# Altium project Beanbag_Board.PrjPcb
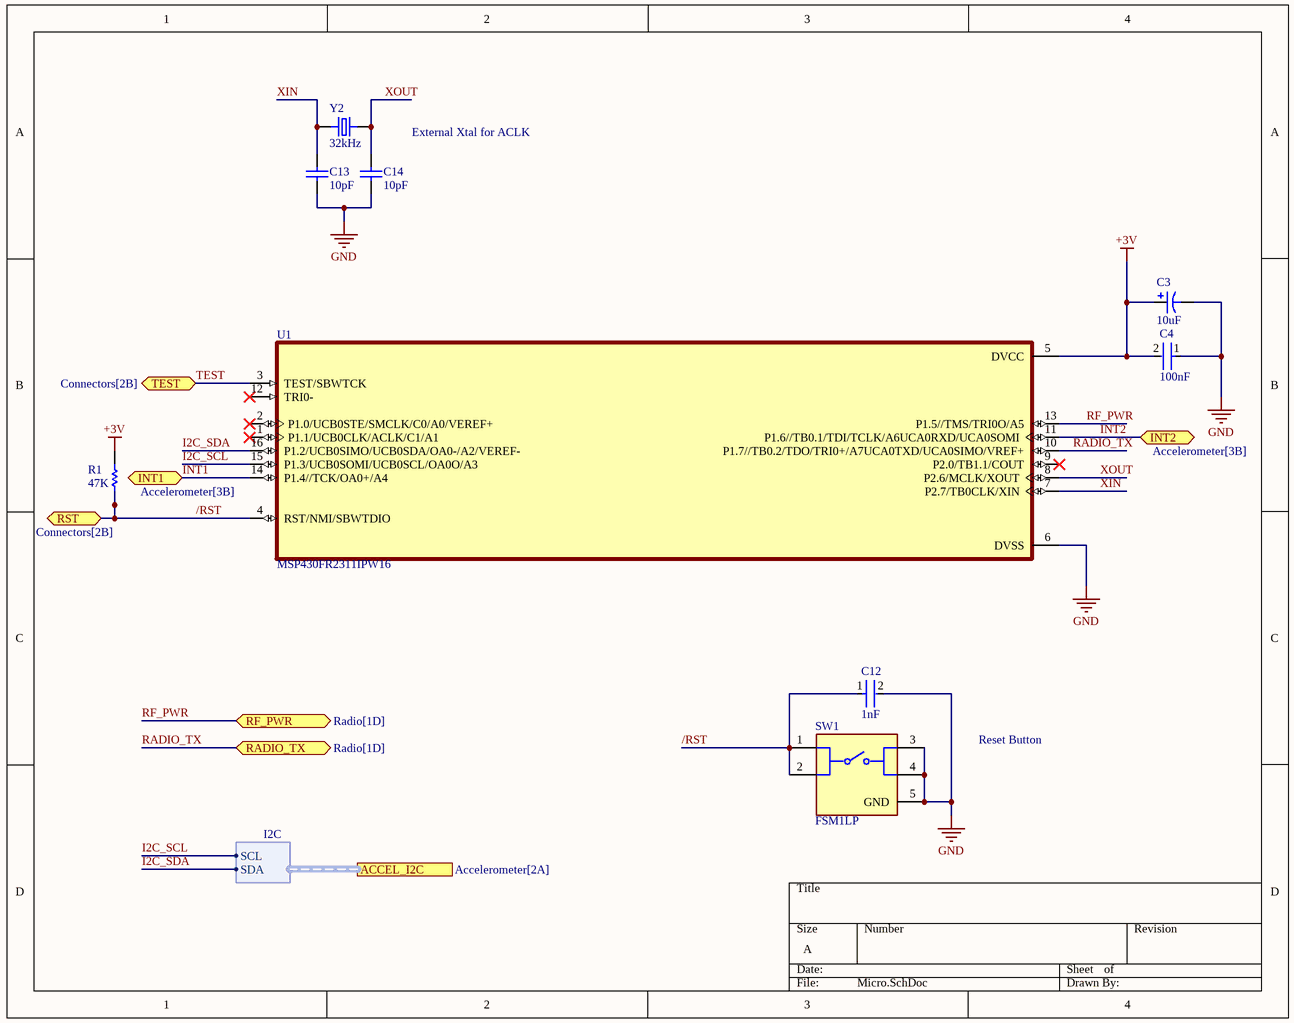
[diagram p0: Micro.SchDoc]
5 sheets, 34 parts. Net scope: flat (ports and power ports of the same name join across sheets).
Board file: Beanbag.PcbDoc
Sheets:
  Micro.SchDoc
  Accelerometer.SchDoc
  Connectors.SchDoc
  Power.SchDoc
  Radio.SchDoc

## Sheet Micro.SchDoc
size A; SheetNumber: 1; SheetTotal: 5; SPICEModelCacheCJDBQKXO: <root> / <DocumentId>CJDBQKXO</DocumentId> / <CacheFrame Number="0"> / <Model Name="cap" Kind="MDL"> / <Text>*Default semiconductor capacitor / .MODEL CAP C()</Text> / </Model> / </CacheFrame> / </root>

### Parts
C3  10uF  [C0805]
C4  100nF  [FP-C0402-BB-MFG]
C12  1nF  [FP-0603-L_1_6_0_15-W_0_81-IPC_A]
C13  10pF  [CAPC1608X90X40ML10T20]
C14  10pF  [CAPC1608X90X40ML10T20]
R1  47K  [J1-0603]
SW1  FSM1LP  [FP-FSM1LP-MFG]
U1  MSP430FR2311IPW16  [SOP65P640X120-16N]
Y2  32kHz  [XTAL_ECS-.327-6-34RR-TR]

### Ports
ACCEL_I2C (harness I2C, see Accelerometer[2A]), INT1 (bidir, see Accelerometer[3B]), INT2 (bidir, see Accelerometer[3B]), RADIO_TX (bidir, see Radio[1D]), RF_PWR (bidir, see Radio[1D]), RST (bidir, see Connectors[2B]), TEST (bidir, see Connectors[2B])

### Harnesses
I2C: SDA, SCL

### Nets
+3V: C3.1 C4.2 R1.2 U1.5(DVCC)
GND: C3.2 C4.1 C12.2 C13.1 C14.1 SW1.3 SW1.4 SW1.5(GND) U1.6(DVSS)
/RST: C12.1 R1.1 SW1.1 SW1.2 U1.4(RST/NMI/SBWTDIO) ; port RST
I2C_SCL: U1.15(P1.3/UCB0SOMI/UCB0SCL/OA0O/A3) ; port ACCEL_I2C.SCL
I2C_SDA: U1.16(P1.2/UCB0SIMO/UCB0SDA/OA0-/A2/VEREF-)
INT1: U1.14(P1.4//TCK/OA0+/A4) ; port INT1
INT2: U1.11(P1.6//TB0.1/TDI/TCLK/A6UCA0RXD/UCA0SOMI) ; port INT2
RADIO_TX: U1.10(P1.7//TB0.2/TDO/TRI0+/A7UCA0TXD/UCA0SIMO/VREF+) ; port RADIO_TX
RF_PWR: U1.13(P1.5//TMS/TRI0O/A5) ; port RF_PWR
TEST: U1.3(TEST/SBWTCK) ; port TEST
XIN: C13.2 U1.7(P2.7/TB0CLK/XIN) Y2.1(I/O)
XOUT: C14.2 U1.8(P2.6/MCLK/XOUT) Y2.2(O/I)

Not connected (* = marked no-connect by the designer): U1 1(P1.1/UCB0CLK/ACLK/C1/A1)* 2(P1.0/UCB0STE/SMCLK/C0/A0/VEREF+)* 9(P2.0/TB1.1/COUT)* 12(TRI0-)*

### Notes on the sheet
- External Xtal for ACLK
- Reset Button

### Library data of the parts
C3 = Cap Pol3: Alum. Electrolytic Cap 10µF 50V; 5mm Surface Mount; Lifetime 2000h; +105°C; Manufacturer: Wurth Electronics; Manufacturer Part Number: 865080642006; Polarity: Polar; Ripple Current: 95mA; Impedance: 2.8R; Life (Hours): 2000Hour; Tolerance: 20%; Published: 8-Jun-2000; LatestRevisionDate: 29-May-2009; LatestRevisionNote: IPC-7351 Footprint Added.; PackageReference: C0805; Publisher: Altium Limited; PackageDescription: Chip Capacitor; RoHS: Yes; Category: Aluminum Electrolytic Capacitors; Stock 1: 1; Pricing 1: 25=0.20400 (USD); Mount: Surface Mount; Case/Package: Radial; Min Operating Temperature: -55°C; Max Operating Temperature: 105°C; Package Quantity: 1; Packaging: Cut Tape; Voltage Rating: 50V; Ripple Current (AC): 95mA; Voltage Rating (DC): 50V; Capacitance: 10uF; Diameter: 5mm; Height: 5.5mm; Height - Seated (Max): 0.217inch; REACH SVHC: Unknown; RoHS Compliant: Yes; ComponentLink1URL: http://www.farnell.com/datasheets/1880176.pdf?src-supplier=Farnell; ComponentLink1Description: http://www.farnell.com/datasheets/1880176.pdf?src-supplier=Farnell; ComponentLink2URL: http://www.farnell.com/datasheets/1880176.pdf?src-supplier=Element14; ComponentLink2Description: http://www.farnell.com/datasheets/1880176.pdf?src-supplier=Element14; ComponentLink3URL: http://www.farnell.com/datasheets/1880176.pdf?src-supplier=Newark; ComponentLink3Description: http://www.farnell.com/datasheets/1880176.pdf?src-supplier=Newark; ComponentLink4URL: http://katalog.we-online.de/pbs/datasheet/865080642006.pdf?src-supplier=Digi-Key; ComponentLink4Description: http://katalog.we-online.de/pbs/datasheet/865080642006.pdf?src-supplier=Digi-Key; ComponentLink5URL: https://katalog.we-online.de/pbs/datasheet/865080642006.pdf?src-supplier=Digi-Key; ComponentLink5Description: https://katalog.we-online.de/pbs/datasheet/865080642006.pdf?src-supplier=Digi-Key; Supplier 1: RSComponents; Supplier Part Number 1: 8391862P
C4 = CMP-2008-02046-2: CAP CER 0.1UF 10V X5R 0402; Manufacturer: Kemet; Manufacturer Part Number: C0402C104K8PACTU; Material: Ceramic; Capacitance: 0.10 μF; Temperature Coefficient: 15%; Tolerance: 0.1; Value: 0.10 μF; Package: C0402-BB; Temperature: -55°C to +125°C; ComponentLink2Description: Datasheet; Temperature Characteristic: X5R; Device Class L1: Passive Components; Height: 0.55mm; Lead Free: Yes; ComponentLink2URL: https://content.kemet.com/datasheets/KEM_C1002_X7R_SMD.pdf; Device Class L2: Capacitors; Temperature Range Low: -55°C; Temperature Range High: +125°C; RoHS: TRUE; Octopart: https://octopart.com/c0402c104k8pactu-kemet-140039; Automotive: No; Mouser Description: Capacitor 100 nF 10 VDC 0402; Category: Cap; Voltage Rating: 10 V; Digikey Description: CAP CER 0.1UF 10V X5R 0402; Ipc Land Pattern Name: CAPC10050X50; Device Class L3: Ceramic Capacitors
C12 = CMP-2006-04378-2: General Purpose Ceramic Capacitor, 0603, 1nF, 10%, X7R, 15%, 50V; Case Code (Metric): 1608; Min Operating Temperature: -55°C; Weight: 7.1E-05oz; Series: -; Capacitance: 1nF; RoHS Compliant: Yes; Radiation Hardening: No; Height: 0.9mm; Mount: Surface Mount; REACH SVHC: No SVHC; Lead Free: Lead Free; Depth: 0.81mm; Voltage: 50V; Number of Pins: 2; Voltage Rating: 50V; Max Operating Temperature: 125°C; Termination: SMD/SMT; Construction: Flat; Case Code (Imperial): 0603; Dielectric: X7R; Width: 0.032inch; Tolerance: 10%; Case/Package: 0603; Contact Plating: Tin; Packaging: Tape and Reel; Voltage Rating (DC): 50V; Dielectric Material: Ceramic; Package Quantity: 4000; Thickness: 0.035inch; Length: 1.6mm; Supplier 1: Arrow Electronics; Supplier Part Number 1: 06035C102KAT2A
C13 C14 = CMP-2100-03593-1: Chip Capacitor, 10 pF, +/- 5%, 50 V, -55 to 125 degC, 0603 (1608 Metric), RoHS, Tape and Reel; Manufacturer: Yageo; Insulation Resistance: 100GR; Voltage Rating: 50V; Temperature Coefficient: 30ppm/degC; Dielectric: C0G; Radiation Hardening: No; Mount: SurfaceMount; Width: 0.031inch; Composition: Ceramic; Package Description: 2-Pin Surface Mount Device, Body 1.6 x 0.8 mm; Min Operating Temperature: -55degC; Case Code (Metric): 1608; Datasheet URL: http://www.yageo.com/documents/recent/UPY-GP_NP0_16V-to-50V_14.pdf; Termination: SMD/SMT; REACH SVHC: NoSVHC; Case/Package: 0603; RoHSCompliant: True; Packaging: TapeandReel; Max Operating Temperature: 125degC; Voltage: 50V; Package Quantity: 1; Manufacturer URL: http://www.yageo.com/; Tolerance: 5%; Capacitance: 10pF; Height: 0.8mm; Depth: 0.8mm; Thickness: 0.035inch; Case Code (Imperial): 0603; Length: 1.6mm; Package Reference: 0603; Voltage Rating (DC): 50V; Lead Free: LeadFree; Number of Pins: 2; Datasheet Version: Rev. 14, 07/2016; Supplier 1: Arrow Electronics; Supplier Part Number 1: CC0603JRNPO9BN100
R1 = Res1: Resistor; Published: 8-Jun-2000; LatestRevisionDate: 17-Jul-2002; LatestRevisionNote: Re-released for DXP Platform.; PackageReference: AXIAL-0.3; Publisher: Altium Limited; PackageDescription: Axial Device, Thru-Hole; 2 Leads; 0.3 in Pin Spacing; Value: 47K
SW1 = CMP-03402-000015-1: SWITCH TACTILE SPST-NO 0.05A 24V; Electrical Life: 100000Cycles; Actuator Type: Standard; Contact Resistance: 100mR; Current Rating: 50mA; Operating Force: 1.57N; Actuator Material: Polyphthalamide; Illumination Type: Non-Illuminated; Actuator Length: 0.01inch; Voltage Rating (DC): 12V; Throw Configuration: SPST; Switch Travel: 0.25mm; Switch Function: Off-Mom; Actuator Color: Black; Length: 6.19mm; Min Operating Temperature: -35°C; Contact Material: Copper Alloy; Max Current Rating: 50mA; Max Operating Temperature: 85°C; Packaging: Loose Piece; Lead Free: Lead Free; Mount: Surface Mount; RoHS Compliant: Yes; Orientation: Straight; Package Quantity: 2000; Mechanical Life: 100000Cycles; Type: Switch; ELV: Compliant; Depth: 8mm; Contact Plating: Silver; Max Voltage Rating (DC): 12V; REACH SVHC: No SVHC; Series: FSM1LP; Contact Current Rating: 50mA; Termination: Gull Wing; Supplier 1: Arrow Electronics; Supplier Part Number 1: FSM1LP
U1 = MSP430FR2311IPW16: 16MHz integrated analog microcontroller with 3.75KB FRAM, Op-Amp, TIA, Comparator w/ DAC, 10-bit ADC 16-TSSOP -40 to 85; MF: Texas Instruments; SnapEDA_Link: https://www.snapeda.com/parts/MSP430FR2311IPW16/Texas+Instruments/view-part/?ref=snap; Availability: In Stock; Package: TSSOP-16 Texas Instruments; Check_prices: https://www.snapeda.com/parts/MSP430FR2311IPW16/Texas+Instruments/view-part/?ref=eda; Price: None; MP: MSP430FR2311IPW16; Purchase-URL: https://pricing.snapeda.com/search/part/MSP430FR2311IPW16/?ref=eda; Value: *
Y2 = ECS-.327-6-34RR-TR: 32.768kHz Â±20ppm Crystal 6pF 40 kOhms 2-SMD, No Lead; MF: ECS Inc.; SnapEDA_Link: https://www.snapeda.com/parts/ECS-.327-6-34RR-TR/ECS%20Inc./view-part/2047718/?ref=snap; Value: *; MP: ECS-.327-6-34RR-TR; Package: SMD-2 TE Connectivity; DigiKey-Purchase-URL: https://snapeda.com/shop?store=DigiKey&id=2047718; Digi-Key_Part_Number: XC2296CT-ND; Supplier 1: Digi-Key; Supplier Part Number 1: XC2296CT-ND

## Sheet Accelerometer.SchDoc
size A; SheetNumber: 2; SheetTotal: 5; SPICEModelCacheEDZXGBKT: <root> / <DocumentId>EDZXGBKT</DocumentId> / <CacheFrame Number="0"> / <Model Name="cap" Kind="MDL"> / <Text>*Default semiconductor capacitor / .MODEL CAP C()</Text> / </Model> / </CacheFrame> / </root>
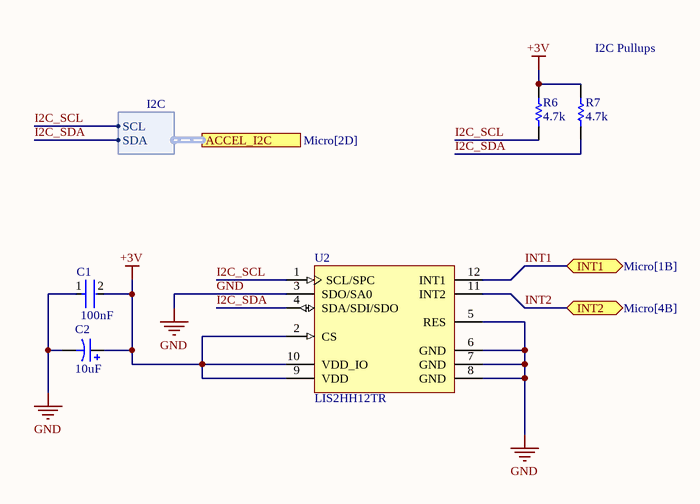
[diagram p1: Accelerometer.SchDoc]

### Parts
C1  100nF  [FP-C0402-BB-MFG]
C2  10uF  [C0805]
R6  4.7k  [RESC1608X55X30NL15T15]
R7  4.7k  [RESC1608X55X30NL15T15]
U2  LIS2HH12TR  [STM-LGA-12]

### Ports
ACCEL_I2C (harness I2C, see Micro[2D]), INT1 (bidir, see Micro[1B]), INT2 (bidir, see Micro[4B])

### Harnesses
I2C: SCL, SDA

### Nets
+3V: C1.2 C2.1 R6.2 R7.2 U2.2(CS) U2.9(VDD) U2.10(VDD_IO)
GND: C1.1 C2.2 U2.3(SDO/SA0) U2.5(RES) U2.6(GND) U2.7(GND) U2.8(GND)
I2C_SCL: R6.1 U2.1(SCL/SPC)
I2C_SDA: R7.1 U2.4(SDA/SDI/SDO) ; port ACCEL_I2C.SDA
INT1: U2.12(INT1) ; port INT1
INT2: U2.11(INT2) ; port INT2

### Notes on the sheet
- I2C Pullups

### Library data of the parts
C1 = CMP-2008-02046-2: as C4 on sheet Micro; Package: C0402-BB; Temperature: -55°C to +125°C; ComponentLink2Description: Datasheet; Temperature Characteristic: X5R; Device Class L1: Passive Components; Height: 0.55mm; Lead Free: Yes; ComponentLink2URL: https://content.kemet.com/datasheets/KEM_C1002_X7R_SMD.pdf; Device Class L2: Capacitors; Temperature Range Low: -55°C; Temperature Range High: +125°C; RoHS: TRUE; Octopart: https://octopart.com/c0402c104k8pactu-kemet-140039; Automotive: No; Mouser Description: Capacitor 100 nF 10 VDC 0402; Category: Cap; Voltage Rating: 10 V; Digikey Description: CAP CER 0.1UF 10V X5R 0402; Ipc Land Pattern Name: CAPC10050X50; Device Class L3: Ceramic Capacitors
C2 = Cap Pol3: as C3 on sheet Micro; Published: 8-Jun-2000; LatestRevisionDate: 29-May-2009; LatestRevisionNote: IPC-7351 Footprint Added.; PackageReference: C0805; Publisher: Altium Limited; PackageDescription: Chip Capacitor; RoHS: Yes; Category: Aluminum Electrolytic Capacitors; Stock 1: 1; Pricing 1: 25=0.20400 (USD); Mount: Surface Mount; Case/Package: Radial; Min Operating Temperature: -55°C; Max Operating Temperature: 105°C; Package Quantity: 1; Packaging: Cut Tape; Voltage Rating: 50V; Ripple Current (AC): 95mA; Voltage Rating (DC): 50V; Capacitance: 10uF; Diameter: 5mm; Height: 5.5mm; Height - Seated (Max): 0.217inch; REACH SVHC: Unknown; RoHS Compliant: Yes; ComponentLink1URL: http://www.farnell.com/datasheets/1880176.pdf?src-supplier=Farnell; ComponentLink1Description: http://www.farnell.com/datasheets/1880176.pdf?src-supplier=Farnell; ComponentLink2URL: http://www.farnell.com/datasheets/1880176.pdf?src-supplier=Element14; ComponentLink2Description: http://www.farnell.com/datasheets/1880176.pdf?src-supplier=Element14; ComponentLink3URL: http://www.farnell.com/datasheets/1880176.pdf?src-supplier=Newark; ComponentLink3Description: http://www.farnell.com/datasheets/1880176.pdf?src-supplier=Newark; ComponentLink4URL: http://katalog.we-online.de/pbs/datasheet/865080642006.pdf?src-supplier=Digi-Key; ComponentLink4Description: http://katalog.we-online.de/pbs/datasheet/865080642006.pdf?src-supplier=Digi-Key; ComponentLink5URL: https://katalog.we-online.de/pbs/datasheet/865080642006.pdf?src-supplier=Digi-Key; ComponentLink5Description: https://katalog.we-online.de/pbs/datasheet/865080642006.pdf?src-supplier=Digi-Key; Supplier 1: RSComponents; Supplier Part Number 1: 8391862P
R6 R7 = CMP-1012-00586-3: Precision Thick Film Chip Resistor, 4.7 KOhm, +/- 1%, -55 to 155 degC, 0603 (1608 Metric), RoHS, Tape and Reel; Resistance: 220 Ohm; Voltage Rating: 50 V; Elements: 4; Case\Package: 1205; Tolerance: 5%; Power Rating: 250 mW; PackageReference: 0603; Max Operating Temperature: 125 degC; REACH SVHC: No SVHC; Width: 0.063 inch; Length: 0.126 inch; Height: 0.024 inch; Mount: Surface Mount; Package Quantity: 1; DatasheetVersion: Apr-15; ComponentLink1Description: Manufacturer URL; Min Operating Temperature: -55 degC; Packaging: Tape and Reel; Radiation Hardening: No; ComponentLink2URL: http://industrial.panasonic.com/cdbs/www-data/pdf/RDA0000/AOA0000C86.pdf; Case Code (Metric): 3216; Pins: 8; Case Code (Imperial): 1206; Type (Resistor): Thick Film; RoHSCompliant: true; ComponentLink2Description: Datasheet; PackageDescription: 2-Pin Surface Mount Device, Body 1.6 x 0.85 mm; ComponentLink1URL: http://www.panasonic.com/; Supplier 1: Digi-Key; Supplier Part Number 1: P4.70KHCT-ND
U2 = CMP-2000-07462-1: MEMS Digital Output Motion Sensor: Ultra-Low-Power High-Performance 3-Axis "Pico" Accelerometer, 1.71 to 3.6 V, -40 to 85 degC, 12-Pin LGA, RoHS, Tape and Reel; Manufacturer: STMicroelectronics; Bandwidth: 400Hz; Package Description: 12-Pin Land Grid Array Package, Body 2 x 2 mm, Pitch 0.5 mm; Manufacturer URL: http://www.st.com/; Lead Free: LeadFree; Case\/Package: LGA; RoHSCompliant: true; Min Operating Temperature: -40degC; Mounting Technology: SurfaceMount; Packaging: TapeandReel; Max Operating Temperature: 85degC; Mount: SurfaceMount; Number of Pins: 12; Datasheet URL: http://www.st.com/content/ccc/resource/technical/document/datasheet/c9/16/f2/79/ca/31/47/89/DM00096789.pdf/files/DM00096789.pdf/jcr:content/translations/en.DM00096789.pdf; Contact Plating: Gold; Package Reference: LGA-12; Datasheet Version: Rev. 5, 12/2015

## Sheet Connectors.SchDoc
size A; SheetNumber: 3; SheetTotal: 5
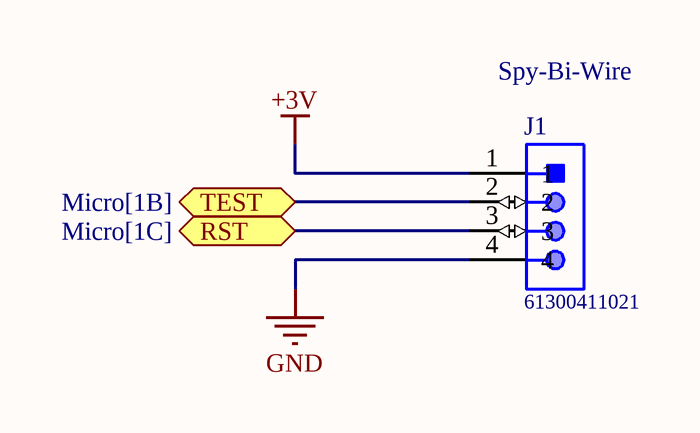
[diagram p2: Connectors.SchDoc]

### Parts
J1  61300411021  [61300411021]

### Ports
RST (bidir, see Micro[1C]), TEST (bidir, see Micro[1B])

### Nets
+3V: J1.1
GND: J1.4
/RST: J1.3 ; port RST
TEST: J1.2 ; port TEST

### Notes on the sheet
- (near J1) Spy-Bi-Wire

### Library data of the parts
J1 = CMP-1502-01063-1: THT Angled Pin Header WR-PHD, Pitch 2.54 mm, Single Row, 4 pins; Manufacturer: Wurth Elektronik; Gender: Male; Pin Number: 4; Withstanding Voltage: 500VAC; Working Voltage: 250VAC; Contact Resistance: 20mOhm; Pitch: 2.54mm; Rated Current: 3A; Manufacturer URL: http://www.we-online.de; Mounting Technology: THT; Publisher: WurthElektronik; Operating Temperature: -40to105degC; Packaging: Bag; Row Number: Single; Package Reference: 61300411021; Part Number: 61300411021; Orientation: Angled; Datasheet URL: https://katalog.we-online.de/em/datasheet/6130xx11021.pdf

## Sheet Power.SchDoc
size A; SheetNumber: 4; SheetTotal: 5
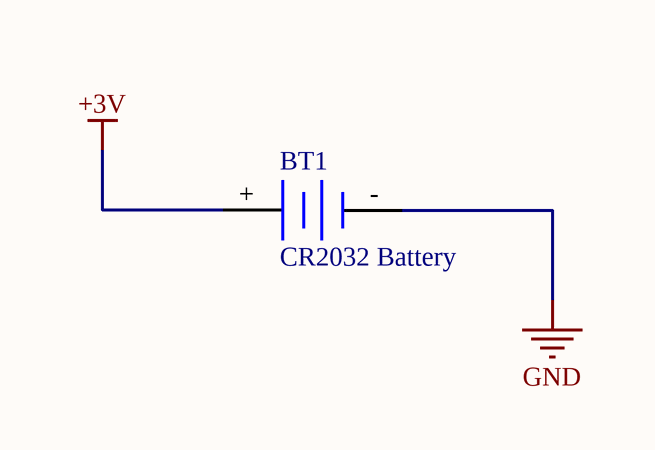
[diagram p3: Power.SchDoc]

### Parts
BT1  CR2032 Battery  [PCBComponent_1]

### Nets
+3V: BT1.+
GND: BT1.-

### Library data of the parts
BT1 = Battery: Multicell Battery; pin to pad: 1>+ 2>-; Published: 24-Mar-1999; LatestRevisionDate: 17-Jul-2002; LatestRevisionNote: Re-released for DXP Platform.; PackageReference: BAT-2; Publisher: Altium Limited; PackageDescription: Battery; 2 Leads; Supplier 1: Digi-Key; Supplier Part Number 1: 2057-BH-49E-5-BK-ND

## Sheet Radio.SchDoc
size A; SheetNumber: 5; SheetTotal: 5; SPICEModelCacheYGONGDQV: <root> / <DocumentId>YGONGDQV</DocumentId> / <CacheFrame Number="0"> / <Model Name="pmos" Kind="MDL"> / <Text>*Default P-Channel MOSFET / *Pinout: D,G,S / .MODEL PMOS PMOS()</Text> / </Model> / <Model Name="cap" Kind="MDL"> / <Text>*Default semiconductor capacitor / .MODEL CAP C()</Text> / </Model> / </CacheFrame> / </root>
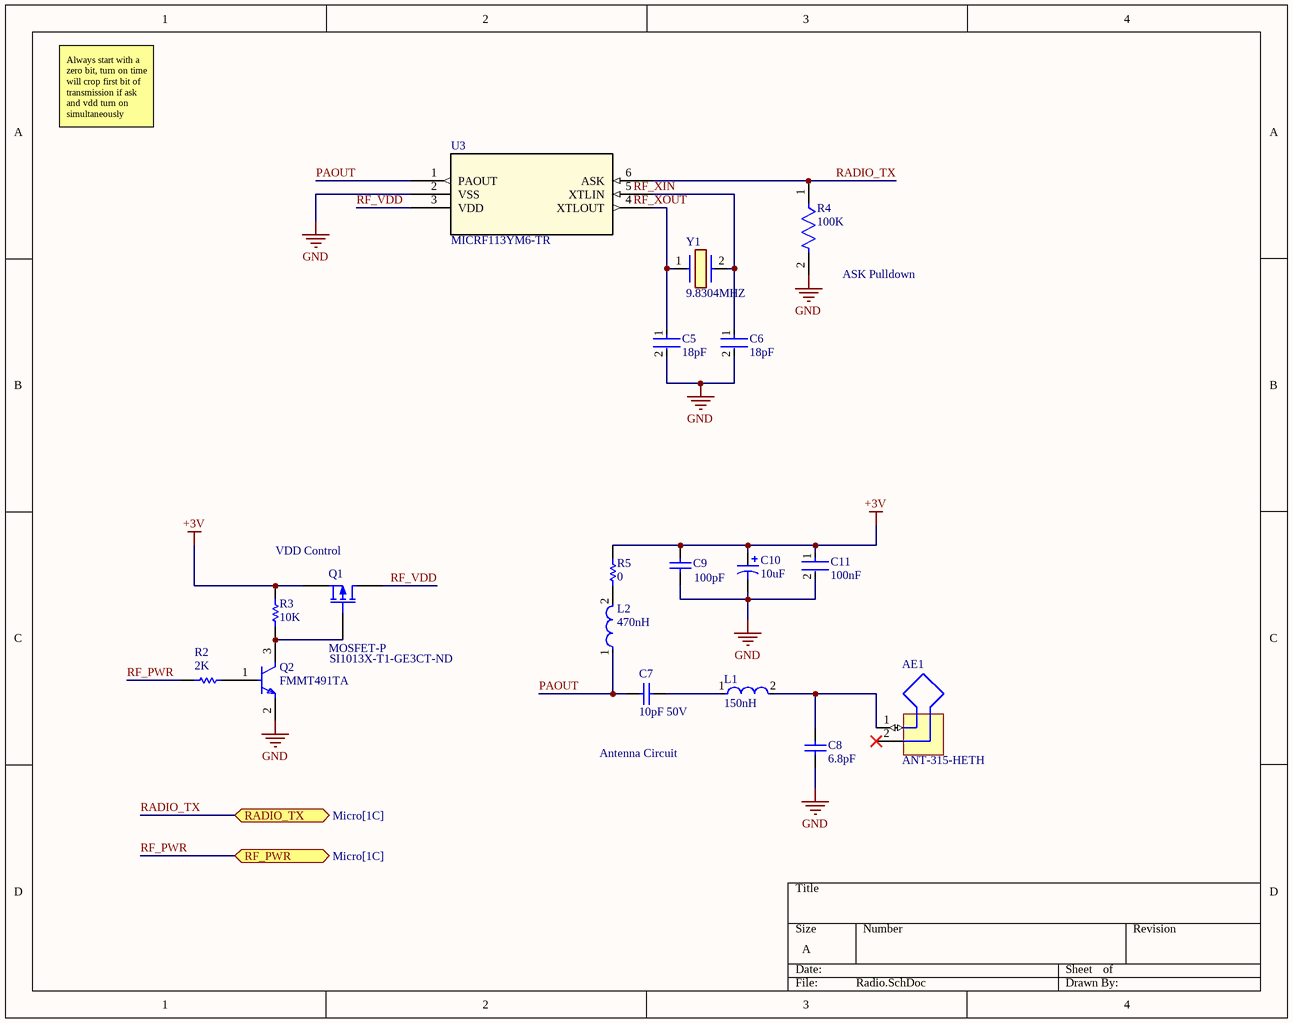
[diagram p4: Radio.SchDoc]

### Parts
AE1  ANT-315-HETH  [ANT-xxx-HETH]
C5  18pF  [FP-0402-L_1_0_1-W_0_5_0_1-MFG]
C6  18pF  [FP-0402-L_1_0_1-W_0_5_0_1-MFG]
C7  10pF 50V  [CAPC1608X90X35LL10T15]
C8  6.8pF  [CAPC1005X55X25NL05T10]
C9  100pF  [CAPC1608X90X35NL10T15]
C10  10uF  [C0805]
C11  100nF  [FP-C0402-BB-MFG]
L1  150nH  [FP-LQM18NN_00-IPC_B]
L2  470nH  [FP-LQW2UAS_00-MFG]
Q1  MOSFET-P  Supplier Part Number 1: SI1013X-T1-GE3CT-ND  [SC89-3_0P95X1P7_ONS]
Q2  FMMT491TA  [FP-SOT23-MFG]
R2  2K  [RESC1005X40X25LL05T05]
R3  10K  [RESC1005X40X25LL05T05]
R4  100K  [FP-ERJ2RK-IPC_C]
R5  0  [RESC1005X40X25LL05T05]
U3  MICRF113YM6-TR  [SOT23-6_N]
Y1  9.8304MHZ  [HC/49US-(AT49)_1]

### Ports
RADIO_TX (bidir, see Micro[1C]), RF_PWR (bidir, see Micro[1C])

### Nets
+3V: C9.2 C10.1 C11.1 Q1.3(S) R3.2 R5.2
GND: C5.2 C6.2 C8.1 C9.1 C10.2 C11.2 Q2.2(E) R4.2 U3.2(VSS)
PAOUT: C7.1 L2.1 U3.1(PAOUT)
RADIO_TX: R4.1 U3.6(ASK) ; port RADIO_TX
RF_PWR: R2.1 ; port RF_PWR
RF_VDD: Q1.1(D) U3.3(VDD)
NetAE1_1: AE1.1(High_Band_Feed) C8.2 L1.2
NetC5_1: C5.1 U3.4(XTLOUT) Y1.1
NetC6_1: C6.1 U3.5(XTLIN) Y1.2
NetC7_2: C7.2 L1.1
NetL2_2: L2.2 R5.1
NetQ1_2: Q1.2(G) Q2.3(C) R3.1
NetQ2_1: Q2.1(B) R2.2

Not connected (* = marked no-connect by the designer): AE1 2(Low_Band_Feed)*

### Notes on the sheet
- Always start with a zero bit, turn on time will crop first bit of transmission if ask and vdd turn on simultaneously
- (near R4) ASK Pulldown
- VDD Control
- Antenna Circuit
- Labels drawn without touching a wire or pin: RF_XIN, RF_XOUT

### Library data of the parts
AE1 = CMP-0172-00019-1: Embeddable 1/4-wave Monopole Antenna, HE Series, 315MHz, Thru-Hole; PackageReference: ANT-xxx-HETH; PackageDescription: Helical Antenna, HE Series, Thru-Hole, 2-Lead, 1.5" x 0.35" Body; DatasheetVersion: Feb-2002; PackageVersion: Feb-2002
C5 C6 = CMP-1034-00865-3: General Purpose Ceramic Capacitor, 0402, 18pF, 5%, C0G, 30ppm/°C, 50V; Insulation Resistance: 100GR; Length: 1mm; Voltage Rating (DC): 50V; Dielectric: C0G; Dielectric Material: Ceramic; Thickness: 0.022inch; Max Operating Temperature: 125°C; Min Operating Temperature: -55°C; RoHS Compliant: Yes; Package Quantity: 1; Mount: Surface Mount; Case Code (Imperial): 0402; REACH SVHC: No SVHC; Termination: SMD/SMT; Voltage: 50V; Number of Pins: 2; Contact Plating: Tin; Radiation Hardening: No; Voltage Rating: 50V; Capacitance: 18pF; Case Code (Metric): 1005; Case/Package: 0402; Tolerance: 5%; Packaging: Tape and Reel; Temperature Coefficient: 0ppm/°C; Depth: 0.5mm; Width: 0.02inch; Lead Free: Lead Free; Height: 0.5mm
C7 = CMP-2006-02592-1: Part Number: GRM1885C1H100JA01D; Manufacturer: Murata; Supplier 1: Digi-Key; Supplier Part Number 1: 490-1403-1-ND
C8 = CMP-2008-04424-1: Manufacturer: Murata; Part Number: GRM1555C1H6R8DA01D
C9 = CMP-2006-02595-1: Part Number: GRM1885C1H101JA01D; Manufacturer: Murata; Supplier 1: Digi-Key; Supplier Part Number 1: 490-1427-6-ND
C10 = Cap Pol3: as C3 on sheet Micro; Published: 8-Jun-2000; LatestRevisionDate: 29-May-2009; LatestRevisionNote: IPC-7351 Footprint Added.; PackageReference: C0805; Publisher: Altium Limited; PackageDescription: Chip Capacitor; RoHS: Yes; Category: Aluminum Electrolytic Capacitors; Stock 1: 1; Pricing 1: 25=0.20400 (USD); Mount: Surface Mount; Case/Package: Radial; Min Operating Temperature: -55°C; Max Operating Temperature: 105°C; Package Quantity: 1; Packaging: Cut Tape; Voltage Rating: 50V; Ripple Current (AC): 95mA; Voltage Rating (DC): 50V; Capacitance: 10uF; Diameter: 5mm; Height: 5.5mm; Height - Seated (Max): 0.217inch; REACH SVHC: Unknown; RoHS Compliant: Yes; ComponentLink1URL: http://www.farnell.com/datasheets/1880176.pdf?src-supplier=Farnell; ComponentLink1Description: http://www.farnell.com/datasheets/1880176.pdf?src-supplier=Farnell; ComponentLink2URL: http://www.farnell.com/datasheets/1880176.pdf?src-supplier=Element14; ComponentLink2Description: http://www.farnell.com/datasheets/1880176.pdf?src-supplier=Element14; ComponentLink3URL: http://www.farnell.com/datasheets/1880176.pdf?src-supplier=Newark; ComponentLink3Description: http://www.farnell.com/datasheets/1880176.pdf?src-supplier=Newark; ComponentLink4URL: http://katalog.we-online.de/pbs/datasheet/865080642006.pdf?src-supplier=Digi-Key; ComponentLink4Description: http://katalog.we-online.de/pbs/datasheet/865080642006.pdf?src-supplier=Digi-Key; ComponentLink5URL: https://katalog.we-online.de/pbs/datasheet/865080642006.pdf?src-supplier=Digi-Key; ComponentLink5Description: https://katalog.we-online.de/pbs/datasheet/865080642006.pdf?src-supplier=Digi-Key; Supplier 1: RSComponents; Supplier Part Number 1: 8391862P
C11 = CMP-2008-02046-2: as C4 on sheet Micro; Package: C0402-BB; Temperature: -55°C to +125°C; ComponentLink2Description: Datasheet; Temperature Characteristic: X5R; Device Class L1: Passive Components; Height: 0.55mm; Lead Free: Yes; ComponentLink2URL: https://content.kemet.com/datasheets/KEM_C1002_X7R_SMD.pdf; Device Class L2: Capacitors; Temperature Range Low: -55°C; Temperature Range High: +125°C; RoHS: TRUE; Octopart: https://octopart.com/c0402c104k8pactu-kemet-140039; Automotive: No; Mouser Description: Capacitor 100 nF 10 VDC 0402; Category: Cap; Voltage Rating: 10 V; Digikey Description: CAP CER 0.1UF 10V X5R 0402; Ipc Land Pattern Name: CAPC10050X50; Device Class L3: Ceramic Capacitors
L1 = CMP-06042-016466-1: Multilayer Type Inductor for General Circuits, 0603 (1608), 150nH, 10%, 0.6Ω, 50mA; Shielding: Shielded; Inductor Type: MONOLITHIC; Q Factor: 15; DC Resistance (DCR): 600mR; Self Resonant Frequency: 180MHz; Test Frequency: 25MHz; Core Material: Ferrite; Military Standard: Not; Inductance Tolerance: 10%; Length: 1.6mm; Tolerance: 10%; Height - Seated (Max): 0.035inch; Inductance: 150nH; Current Rating: 50mA; REACH SVHC: No SVHC; Case Code (Imperial): 0603; Series: LQM18N; Width: 0.8mm; Packaging: Tape and Reel; DC Current: 50mA; Termination: SMD/SMT; Max Operating Temperature: 85°C; Package Quantity: 4000; Case/Package: 0603; Case Code (Metric): 1608; Number of Pins: 2; Height: 0.8mm; Min Operating Temperature: -40°C; Max DC Current: 50mA; Lead Free: Lead Free; Depth: 0.95mm; Mount: Surface Mount; Supplier 1: Digi-Key; Supplier Part Number 1: 490-4033-1-ND
L2 = CMP-06042-015512-1: Wire Wound RF Inductor 470nH ±5% 470mA 1.19Ω 1008 (2520); Test Frequency: 25MHz; DC Resistance (DCR): 1.19R; Core Material: Air; Shielding: Unshielded; Self Resonant Frequency: 450MHz; Q Factor: 45; Case Code (Metric): 2520; Packaging: Tape and Reel; Inductance: 470nH; Tolerance: 5%; Width: 0.096inch; Radiation Hardening: No; Case Code (Imperial): 1008; Resistor Type: Wirewound; Depth: 2.65mm; Min Operating Temperature: -55°C; Inductance Tolerance: 5%; Max DC Current: 470mA; Mount: Surface Mount; Series: LQW2UA; Max Operating Temperature: 125°C; REACH SVHC: No SVHC; Termination: SMD/SMT; Current Rating: 470mA; Height - Seated (Max): 0.08inch; Package Quantity: 2000; Height: 1.83mm; Lead Free: Lead Free; Length: 0.103inch; Weight: 0.001376oz; Case/Package: 1008; Supplier 1: Digi-Key; Supplier Part Number 1: 490-5699-6-ND
Q1 = MOSFET-P: Single P-Channel 20 V 1.2 Ohm Surface Mount Power Mosfet - SC-89; Manufacturer: Vishay Siliconix; Manufacturer Part Number: SI1013X-T1-GE3; Rds On Max: 1.2R; Rise Time: 9ns; Drain to Source Voltage (Vdss): 20V; Continuous Drain Current (ID): 350mA; Max Power Dissipation: 250mW; Gate to Source Voltage (Vgs): 6V; Turn-Off Delay Time: 35ns; Number of Elements: 1; Turn-On Delay Time: 5ns; Threshold Voltage: -450mV; Drain to Source Breakdown Voltage: -20V; Published: 8-Jun-2000; LatestRevisionDate: 17-Jul-2002; LatestRevisionNote: Re-released for DXP Platform.; PackageVersion: 1995/1996; PackageReference: E3; Publisher: Altium Limited; PackageDescription: TO, Flat Index; 3 In-Line, Axial Leads; Body Dia. 4.6mm; Lead Dia. 0.5 mm (max); Supplier 1: Digi-Key; RoHS: Yes; Category: MOSFETs; Stock 1: 2646; Pricing 1: 1=0.46000, 10=0.39200, 100=0.29260, 500=0.22990, 1000=0.17765 (USD); Mount: Surface Mount; Case/Package: SC; Number of Pins: 3; Weight: 0.001058oz; Min Operating Temperature: -55°C; Max Operating Temperature: 150°C; Package Quantity: 1; Packaging: Tape and Reel; Drain to Source Resistance: 1.2R; Fall Time: 9ns; Power Dissipation: 250mW; Element Configuration: Single; Number of Channels: 1; On-State Resistance: 1.2R; Polarity: P-CHANNEL; Series: TrenchFET®; Drain-source On Resistance-Max: 1.2R; Length: 1.7mm; Width: 0.95mm; Height: 0.8mm; Radiation Hardening: No; REACH SVHC: Unknown; Lead Free: Lead Free; RoHS Compliant: Yes; ComponentLink1URL: https://datasheet.ciiva.com/22671/1825082-22671731.pdf?src-supplier=Element14; ComponentLink1Description: https://datasheet.ciiva.com/22671/1825082-22671731.pdf?src-supplier=Element14; ComponentLink2URL: https://datasheet.ciiva.com/931/71167-931890.pdf?src-supplier=Digi-Key; ComponentLink2Description: https://datasheet.ciiva.com/931/71167-931890.pdf?src-supplier=Digi-Key; ComponentLink3URL: https://datasheet.ciiva.com/931/71167-931891.pdf?src-supplier=Digi-Key; ComponentLink3Description: https://datasheet.ciiva.com/931/71167-931891.pdf?src-supplier=Digi-Key; ComponentLink4URL: https://datasheet.ciiva.com/931/71167-931892.pdf?src-supplier=Digi-Key; ComponentLink4Description: https://datasheet.ciiva.com/931/71167-931892.pdf?src-supplier=Digi-Key; ComponentLink5URL: https://datasheet.ciiva.com/11161/71167-11161420.pdf?src-supplier=Avnet; ComponentLink5Description: https://datasheet.ciiva.com/11161/71167-11161420.pdf?src-supplier=Avnet; ComponentLink6URL: https://datasheet.ciiva.com/16217/71167-16217575.pdf?src-supplier=Future+Electronics; ComponentLink6Description: https://datasheet.ciiva.com/16217/71167-16217575.pdf?src-supplier=Future+Electronics
Q2 = CMP-12798-000044-1: TRANS NPN 60V 1A SOT23-3; Element Configuration: Single; Transition Frequency: 150MHz; Number of Elements: 1; hFE Min: 100; Emitter Base Voltage (VEBO): 5V; Max Power Dissipation: 500mW; Collector Base Voltage (VCBO): 80V; Collector Emitter Saturation Voltage: 160mV; Weight: 0.000282oz; Width: 1.4mm; Collector Emitter Breakdown Voltage: 60V; Gain Bandwidth Product: 150MHz; Voltage Rating (DC): 60V; Max Breakdown Voltage: 60V; Max Collector Current: 1A; Max Operating Temperature: 150°C; Radiation Hardening: No; Number of Pins: 3; Length: 3.04mm; Height: 1.02mm; Packaging: Tape and Reel; Frequency: 150MHz; Min Operating Temperature: -55°C; Current Rating: 1A; Package Quantity: 3000; Mount: Surface Mount; Power Dissipation: 500mW; Case/Package: SOT-23; Polarity: NPN; Termination: SMD/SMT; REACH SVHC: No SVHC; Max Frequency: 150MHz; Lead Free: Lead Free; Collector Emitter Voltage (VCEO): 60V; Continuous Collector Current: 1A; Supplier 1: RSComponents; Supplier Part Number 1: 0274879P
R2 = CMP-2000-07588-1: Chip Resistor, 2 KOhm, +/- 1%, 0.1 W, -55 to 155 degC, 0402 (1005 Metric), RoHS, Tape and Reel; Manufacturer: Panasonic; Manufacturer Part Number: ERJ-2GEJ202X; Power Rating: 100mW; Voltage Rating: 50V; Resistance: 10KOhm; Case\/Package: 0402; Temperature Coefficient: 100ppm\/degreesC; Description: Res Thick Film 0402 2K Ohm 5% 1/10W ±200ppm/°C Molded SMD Punched Carrier T/R; Resistance Tolerance: 5%; RoHSCompliant: True; Lead Free: LeadFree; Package Quantity: 1; Contact Plating: Tin; Length: 1mm; Radiation Hardening: No; REACH SVHC: NoSVHC; Max Operating Temperature: 155degC; Depth: 0.5mm; Case Code (Imperial): 0402; Military Standard: Not; Package Description: 2-Pin Surface Mount Device, Body 1 x 0.5 mm; Termination: SMD/SMT; Case Code (Metric): 1005; Height: 0.35mm; Packaging: TapeandReel; Voltage Rating (DC): 50V; Package Reference: 402; Number of Pins: 2; Tolerance: 1%; Mounting Technology: SurfaceMount; Width: 0.02inch; Mount: SurfaceMount; Datasheet URL: https://industrial.panasonic.com/cdbs/www-data/pdf/RDA0000/AOA0000C304.pdf; Composition: ThickFilm; Datasheet Version: 02/2017; Manufacturer URL: http://www.panasonic.com/; Max Power Dissipation: 100mW; Number of Terminations: 2; Min Operating Temperature: -55degC; Supplier 1: RSComponents; RoHS: Yes; Category: Chip SMD Resistors; Stock 1: 1; Pricing 1: 10000=0.00900 (USD); Case/Package: 0402; Resistor Type: Thick Film; Series: ERJ; Construction: Rectangular; Features: Automotive AEC-Q200; Technology: THICK FILM; RoHS Compliant: Yes; ComponentLink1URL: https://datasheet.ciiva.com/34303/1986861-34303546.pdf?src-supplier=Jameco; ComponentLink1Description: https://datasheet.ciiva.com/34303/1986861-34303546.pdf?src-supplier=Jameco; ComponentLink2URL: https://datasheet.ciiva.com/11821/0900766b80f806dd-11821274.pdf?src-supplier=RSComponents; ComponentLink2Description: https://datasheet.ciiva.com/11821/0900766b80f806dd-11821274.pdf?src-supplier=RSComponents; ComponentLink3URL: https://datasheet.ciiva.com/43460/1500035-43460382.pdf?src-supplier=Farnell; ComponentLink3Description: https://datasheet.ciiva.com/43460/1500035-43460382.pdf?src-supplier=Farnell; ComponentLink4URL: https://datasheet.ciiva.com/46389/1500035-46389063.pdf?src-supplier=Element14; ComponentLink4Description: https://datasheet.ciiva.com/46389/1500035-46389063.pdf?src-supplier=Element14; ComponentLink5URL: https://datasheet.ciiva.com/28546/1678796-28546090.pdf?src-supplier=Element14; ComponentLink5Description: https://datasheet.ciiva.com/28546/1678796-28546090.pdf?src-supplier=Element14; ComponentLink6URL: https://datasheet.ciiva.com/28673/1678796-28673966.pdf?src-supplier=Element14; ComponentLink6Description: https://datasheet.ciiva.com/28673/1678796-28673966.pdf?src-supplier=Element14; ComponentLink7URL: https://datasheet.ciiva.com/24026/aoa0000ce1-37422-24026406.pdf?src-supplier=Mouser; ComponentLink7Description: https://datasheet.ciiva.com/24026/aoa0000ce1-37422-24026406.pdf?src-supplier=Mouser; ComponentLink8URL: https://datasheet.ciiva.com/16760/70260739-16760199.pdf?src-supplier=Allied+Electronics; ComponentLink8Description: https://datasheet.ciiva.com/16760/70260739-16760199.pdf?src-supplier=Allied+Electronics; ComponentLink9URL: https://datasheet.ciiva.com/16760/70260739-16760559.pdf?src-supplier=Allied+Electronics; ComponentLink9Description: https://datasheet.ciiva.com/16760/70260739-16760559.pdf?src-supplier=Allied+Electronics; ComponentLink10URL: https://datasheet.ciiva.com/9197/aoa0000ce1-9197500.pdf?src-supplier=Avnet; ComponentLink10Description: https://datasheet.ciiva.com/9197/aoa0000ce1-9197500.pdf?src-supplier=Avnet; Supplier 2: RSComponents; Stock 2: 1; Pricing 2: 10000=0.00900 (USD)
R3 = CMP-2000-07588-1: Chip Resistor, 10 KOhm, +/- 1%, 0.1 W, -55 to 155 degC, 0402 (1005 Metric), RoHS, Tape and Reel; Manufacturer: Panasonic; Power Rating: 100mW; Voltage Rating: 50V; Resistance: 10KOhm; Case\/Package: 0402; Temperature Coefficient: 100ppm\/degreesC; RoHSCompliant: True; Lead Free: LeadFree; Package Quantity: 1; Contact Plating: Tin; Length: 1mm; Radiation Hardening: No; REACH SVHC: NoSVHC; Max Operating Temperature: 155degC; Depth: 0.5mm; Case Code (Imperial): 0402; Military Standard: Not; Package Description: 2-Pin Surface Mount Device, Body 1 x 0.5 mm; Termination: SMD/SMT; Case Code (Metric): 1005; Height: 0.35mm; Packaging: TapeandReel; Voltage Rating (DC): 50V; Package Reference: 402; Number of Pins: 2; Tolerance: 1%; Mounting Technology: SurfaceMount; Width: 0.02inch; Mount: SurfaceMount; Datasheet URL: https://industrial.panasonic.com/cdbs/www-data/pdf/RDA0000/AOA0000C304.pdf; Composition: ThickFilm; Datasheet Version: 02/2017; Manufacturer URL: http://www.panasonic.com/; Max Power Dissipation: 100mW; Number of Terminations: 2; Min Operating Temperature: -55degC
R4 = CMP-2002-00608-4: RES SMD 100K OHM 1% 1/10W 0402; Resistance: 100kR; Voltage Rating (DC): 50V; Power Rating: 100mW; Temperature Coefficient: 100ppm/°C; Case/Package: 0402; Length: 1mm; Package Quantity: 1; Radiation Hardening: No; Case Code (Metric): 1005; Contact Plating: Tin; Mount: Surface Mount; Depth: 0.5mm; Max Operating Temperature: 155°C; Lead Free: Lead Free; Width: 0.5mm; Composition: Thick Film; Case Code (Imperial): 0402; Tolerance: 1%; Termination: SMD/SMT; Number of Pins: 2; Height: 0.35mm; Voltage Rating: 50V; Military Standard: Not; REACH SVHC: No SVHC; Packaging: Tape and Reel; Min Operating Temperature: -55°C; Max Power Dissipation: 100mW; Features: Automotive AEC-Q200; Number of Terminations: 2; Supplier 1: Arrow Electronics; Supplier Part Number 1: ERJ-2RKF1003X
R5 = CMP-2000-07451-1: Chip Resistor, 0 Ohm, 0.1 W, -55 to 155 degC, 0402 (1005 Metric), RoHS, Tape and Reel; Manufacturer: Panasonic; Voltage Rating (DC): 50V; Temperature Coefficient: 600ppm/��C; Max Power Dissipation: 100mW; Resistance: 0mOhm; Tolerance: 5%; Number of Terminations: 2; Mount: SurfaceMount; Height: 0.35mm; Packaging: TapeandReel; Contact Plating: Tin; Manufacturer URL: http://www.panasonic.com/; Composition: ThickFilm; Max Operating Temperature: 155degC; REACH SVHC: NoSVHC; Case/Package: 0402; Package Reference: 402; Depth: 0.5mm; Package Description: 2-Pin Surface Mount Device, Body 1 x 0.5 mm; Datasheet URL: https://industrial.panasonic.com/cdbs/www-data/pdf/RDA0000/AOA0000C301.pdf; RoHSCompliant: True; Case Code (Imperial): 0402; Military Standard: Not; Min Operating Temperature: -55degC; Power Rating: 100mW; Datasheet Version: 03/2015; Length: 1mm; Case Code (Metric): 1005; Termination: SMD/SMT; Mounting Technology: SurfaceMount; Voltage Rating: 50V; Width: 0.02inch; Package Quantity: 1; Lead Free: LeadFree; Radiation Hardening: No; Supplier 1: Digi-Key; Supplier Part Number 1: P0.0JCT-ND
U3 = MICRF113YM6-TR: No Description Available; Mfr_Name: Microchip; Copyright: Copyright (C) 2022 Ultra Librarian. All rights reserved.; Manufacturer_Part_Number: MICRF113YM6-TR; Digi-Key_Part_Number_1: 576-3229-1-ND; Digi-Key_Part_Number_2: 576-3229-2-ND; Digi-Key_Part_Number_3: 576-3229-2-NDL; Digi-Key_Part_Number_4: 576-3229-6-ND; RefDes: RefDes; Type: DEV
Y1 = ABLS2-16.000MHZ-D4Y-T: Crystal or Oscillator; Manufacturer_Name: ABRACON; Datasheet Link: https://abracon.com/Resonators/ABLS2.pdf; Manufacturer_Part_Number: ABLS2-16.000MHZ-D4Y-T; Mouser Part Number: 815-ABLS2-16-D4Y-T; Mouser Price/Stock: https://www.mouser.co.uk/ProductDetail/ABRACON/ABLS2-16.000MHZ-D4Y-T?qs=LoTOQoUkC8S5C2377M50iA%3D%3D; Arrow Part Number: ABLS2-16.000MHZ-D4Y-T; Arrow Price/Stock: https://www.arrow.com/en/products/abls2-16.000mhz-d4y-t/abracon?region=nac

## Nets that join several sheets
+3V: Micro (C3.1 C4.2 R1.2 U1.5), Accelerometer (7 pins), Connectors (J1.1), Power (BT1.+), Radio (6 pins)
GND: Micro (9 pins), Accelerometer (7 pins), Connectors (J1.4), Power (BT1.-), Radio (9 pins)
/RST: Micro (5 pins), Connectors (J1.3)
INT1: Micro (U1.14), Accelerometer (U2.12)
INT2: Micro (U1.11), Accelerometer (U2.11)
RADIO_TX: Micro (U1.10), Radio (R4.1 U3.6)
RF_PWR: Micro (U1.13), Radio (R2.1)
TEST: Micro (U1.3), Connectors (J1.2)